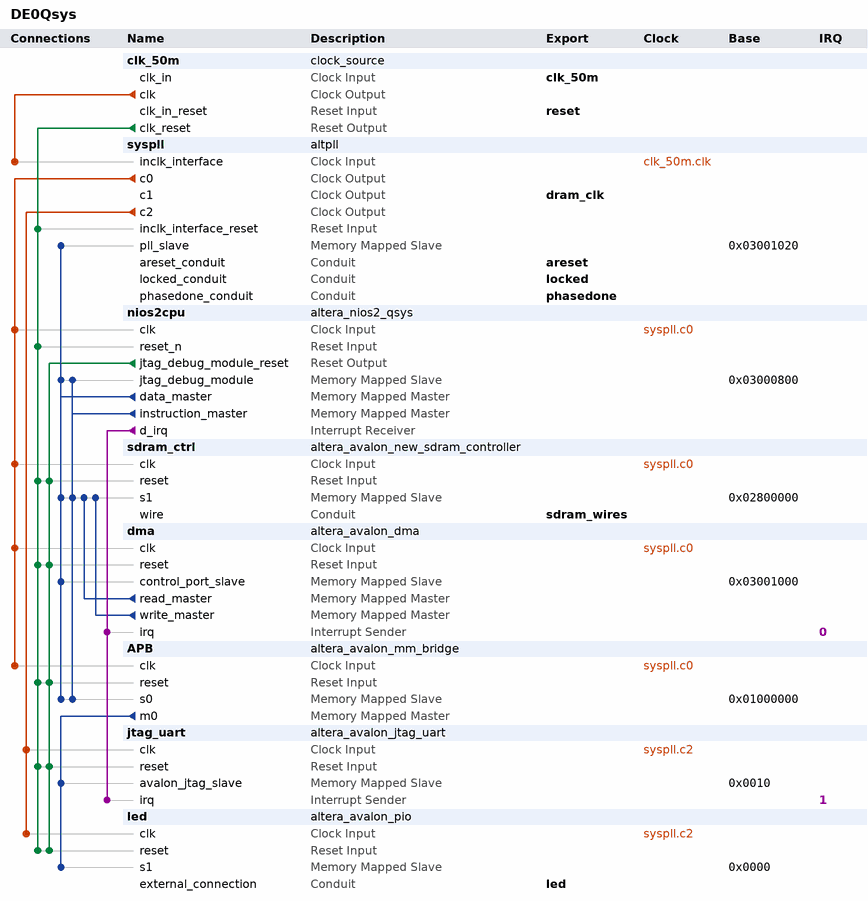
[diagram p0: system contents]
# Platform Designer (Qsys) system DE0Qsys, Cyclone III EP3C16F484C6
# Parameters at their usual value, and those the tool derives, are not listed.
package require -exact qsys 13.0.1.99.2
create_system DE0Qsys
set_project_property DEVICE_FAMILY {Cyclone III}
set_project_property DEVICE EP3C16F484C6

add_instance clk_50m clock_source 13.0
set_instance_parameter_value clk_50m clockFrequency 50000000

add_instance syspll altpll 13.0
set_instance_parameter_value syspll INCLK0_INPUT_FREQUENCY 20000
set_instance_parameter_value syspll CLK0_MULTIPLY_BY 8
set_instance_parameter_value syspll CLK1_MULTIPLY_BY 8
set_instance_parameter_value syspll CLK2_MULTIPLY_BY 1
set_instance_parameter_value syspll CLK0_DIVIDE_BY 3
set_instance_parameter_value syspll CLK1_DIVIDE_BY 3
set_instance_parameter_value syspll CLK2_DIVIDE_BY 5
set_instance_parameter_value syspll CLK1_PHASE_SHIFT -1875
set_instance_parameter_value syspll CLK2_PHASE_SHIFT 0
set_instance_parameter_value syspll CLK1_DUTY_CYCLE 50
set_instance_parameter_value syspll CLK2_DUTY_CYCLE 50
set_instance_parameter_value syspll PORT_clk1 PORT_USED
set_instance_parameter_value syspll PORT_clk2 PORT_USED
set_instance_parameter_value syspll PORT_clk3 PORT_UNUSED
set_instance_parameter_value syspll PORT_ARESET PORT_UNUSED
set_instance_parameter_value syspll PORT_LOCKED PORT_UNUSED

add_instance nios2cpu altera_nios2_qsys 13.0
set_instance_parameter_value nios2cpu resetSlave sdram_ctrl.s1
set_instance_parameter_value nios2cpu mmu_TLBMissExcSlave None
set_instance_parameter_value nios2cpu exceptionSlave sdram_ctrl.s1
set_instance_parameter_value nios2cpu breakSlave nios2cpu.jtag_debug_module
set_instance_parameter_value nios2cpu impl Tiny
set_instance_parameter_value nios2cpu icache_size 4096

add_instance sdram_ctrl altera_avalon_new_sdram_controller 13.0.1.99.2
set_instance_parameter_value sdram_ctrl TAC 5.5
set_instance_parameter_value sdram_ctrl TRCD 20.0
set_instance_parameter_value sdram_ctrl TRP 20.0
set_instance_parameter_value sdram_ctrl casLatency 3
set_instance_parameter_value sdram_ctrl columnWidth 8
set_instance_parameter_value sdram_ctrl dataWidth 16
set_instance_parameter_value sdram_ctrl generateSimulationModel false
set_instance_parameter_value sdram_ctrl model single_Micron_MT48LC4M32B2_7_chip
set_instance_parameter_value sdram_ctrl numberOfBanks 4
set_instance_parameter_value sdram_ctrl numberOfChipSelects 1
set_instance_parameter_value sdram_ctrl powerUpDelay 200.0
set_instance_parameter_value sdram_ctrl refreshPeriod 7.8125
set_instance_parameter_value sdram_ctrl rowWidth 12

add_instance dma altera_avalon_dma 13.0.1.99.2
set_instance_parameter_value dma allowByteTransactions true
set_instance_parameter_value dma allowDoubleWordTransactions true
set_instance_parameter_value dma allowHalfWordTransactions true
set_instance_parameter_value dma allowQuadWordTransactions true
set_instance_parameter_value dma burstEnable true
set_instance_parameter_value dma fifoDepth 32
set_instance_parameter_value dma maxBurstSize 128
set_instance_parameter_value dma minimumDmaTransactionRegisterWidth 13

add_instance APB altera_avalon_mm_bridge 13.0
set_instance_parameter_value APB DATA_WIDTH 32
set_instance_parameter_value APB ADDRESS_WIDTH 10
set_instance_parameter_value APB ADDRESS_UNITS SYMBOLS
set_instance_parameter_value APB MAX_PENDING_RESPONSES 4

add_instance jtag_uart altera_avalon_jtag_uart 13.0.1.99.2
set_instance_parameter_value jtag_uart simInteractiveOptions NO_INTERACTIVE_WINDOWS

add_instance led altera_avalon_pio 13.0.1.99.2
set_instance_parameter_value led direction Output
set_instance_parameter_value led width 10

# connections
add_connection clk_50m.clk syspll.inclk_interface clock
add_connection syspll.c0 APB.clk clock
add_connection syspll.c0 dma.clk clock
add_connection syspll.c0 nios2cpu.clk clock
add_connection syspll.c0 sdram_ctrl.clk clock
add_connection syspll.c2 jtag_uart.clk clock
add_connection syspll.c2 led.clk clock
add_connection clk_50m.clk_reset APB.reset reset
add_connection clk_50m.clk_reset dma.reset reset
add_connection clk_50m.clk_reset jtag_uart.reset reset
add_connection clk_50m.clk_reset led.reset reset
add_connection clk_50m.clk_reset nios2cpu.reset_n reset
add_connection clk_50m.clk_reset sdram_ctrl.reset reset
add_connection clk_50m.clk_reset syspll.inclk_interface_reset reset
add_connection nios2cpu.jtag_debug_module_reset APB.reset reset
add_connection nios2cpu.jtag_debug_module_reset dma.reset reset
add_connection nios2cpu.jtag_debug_module_reset jtag_uart.reset reset
add_connection nios2cpu.jtag_debug_module_reset led.reset reset
add_connection nios2cpu.jtag_debug_module_reset sdram_ctrl.reset reset
add_connection APB.m0 jtag_uart.avalon_jtag_slave avalon
set_connection_parameter_value APB.m0/jtag_uart.avalon_jtag_slave baseAddress 0x0010
add_connection APB.m0 led.s1 avalon
set_connection_parameter_value APB.m0/led.s1 baseAddress 0x0000
add_connection dma.read_master sdram_ctrl.s1 avalon
set_connection_parameter_value dma.read_master/sdram_ctrl.s1 baseAddress 0x02800000
add_connection dma.write_master sdram_ctrl.s1 avalon
set_connection_parameter_value dma.write_master/sdram_ctrl.s1 baseAddress 0x02800000
add_connection nios2cpu.data_master APB.s0 avalon
set_connection_parameter_value nios2cpu.data_master/APB.s0 baseAddress 0x01000000
add_connection nios2cpu.data_master dma.control_port_slave avalon
set_connection_parameter_value nios2cpu.data_master/dma.control_port_slave baseAddress 0x03001000
add_connection nios2cpu.data_master nios2cpu.jtag_debug_module avalon
set_connection_parameter_value nios2cpu.data_master/nios2cpu.jtag_debug_module baseAddress 0x03000800
add_connection nios2cpu.data_master sdram_ctrl.s1 avalon
set_connection_parameter_value nios2cpu.data_master/sdram_ctrl.s1 baseAddress 0x02800000
add_connection nios2cpu.data_master syspll.pll_slave avalon
set_connection_parameter_value nios2cpu.data_master/syspll.pll_slave baseAddress 0x03001020
add_connection nios2cpu.instruction_master APB.s0 avalon
set_connection_parameter_value nios2cpu.instruction_master/APB.s0 baseAddress 0x01000000
add_connection nios2cpu.instruction_master nios2cpu.jtag_debug_module avalon
set_connection_parameter_value nios2cpu.instruction_master/nios2cpu.jtag_debug_module baseAddress 0x03000800
add_connection nios2cpu.instruction_master sdram_ctrl.s1 avalon
set_connection_parameter_value nios2cpu.instruction_master/sdram_ctrl.s1 baseAddress 0x02800000
add_connection nios2cpu.d_irq dma.irq interrupt
set_connection_parameter_value nios2cpu.d_irq/dma.irq irqNumber 0
add_connection nios2cpu.d_irq jtag_uart.irq interrupt
set_connection_parameter_value nios2cpu.d_irq/jtag_uart.irq irqNumber 1

# exported interfaces
add_interface clk_50m clock sink
set_interface_property clk_50m EXPORT_OF clk_50m.clk_in
add_interface reset reset sink
set_interface_property reset EXPORT_OF clk_50m.clk_in_reset
add_interface dram_clk clock source
set_interface_property dram_clk EXPORT_OF syspll.c1
add_interface sdram_wires conduit end
set_interface_property sdram_wires EXPORT_OF sdram_ctrl.wire
add_interface areset conduit end
set_interface_property areset EXPORT_OF syspll.areset_conduit
add_interface locked conduit end
set_interface_property locked EXPORT_OF syspll.locked_conduit
add_interface phasedone conduit end
set_interface_property phasedone EXPORT_OF syspll.phasedone_conduit
add_interface led conduit end
set_interface_property led EXPORT_OF led.external_connection

set_interconnect_requirement {$system} qsys_mm.clockCrossingAdapter HANDSHAKE
set_interconnect_requirement {$system} qsys_mm.maxAdditionalLatency 1

save_system DE0Qsys.qsys
